# Altium project NixieProject.PrjPcb
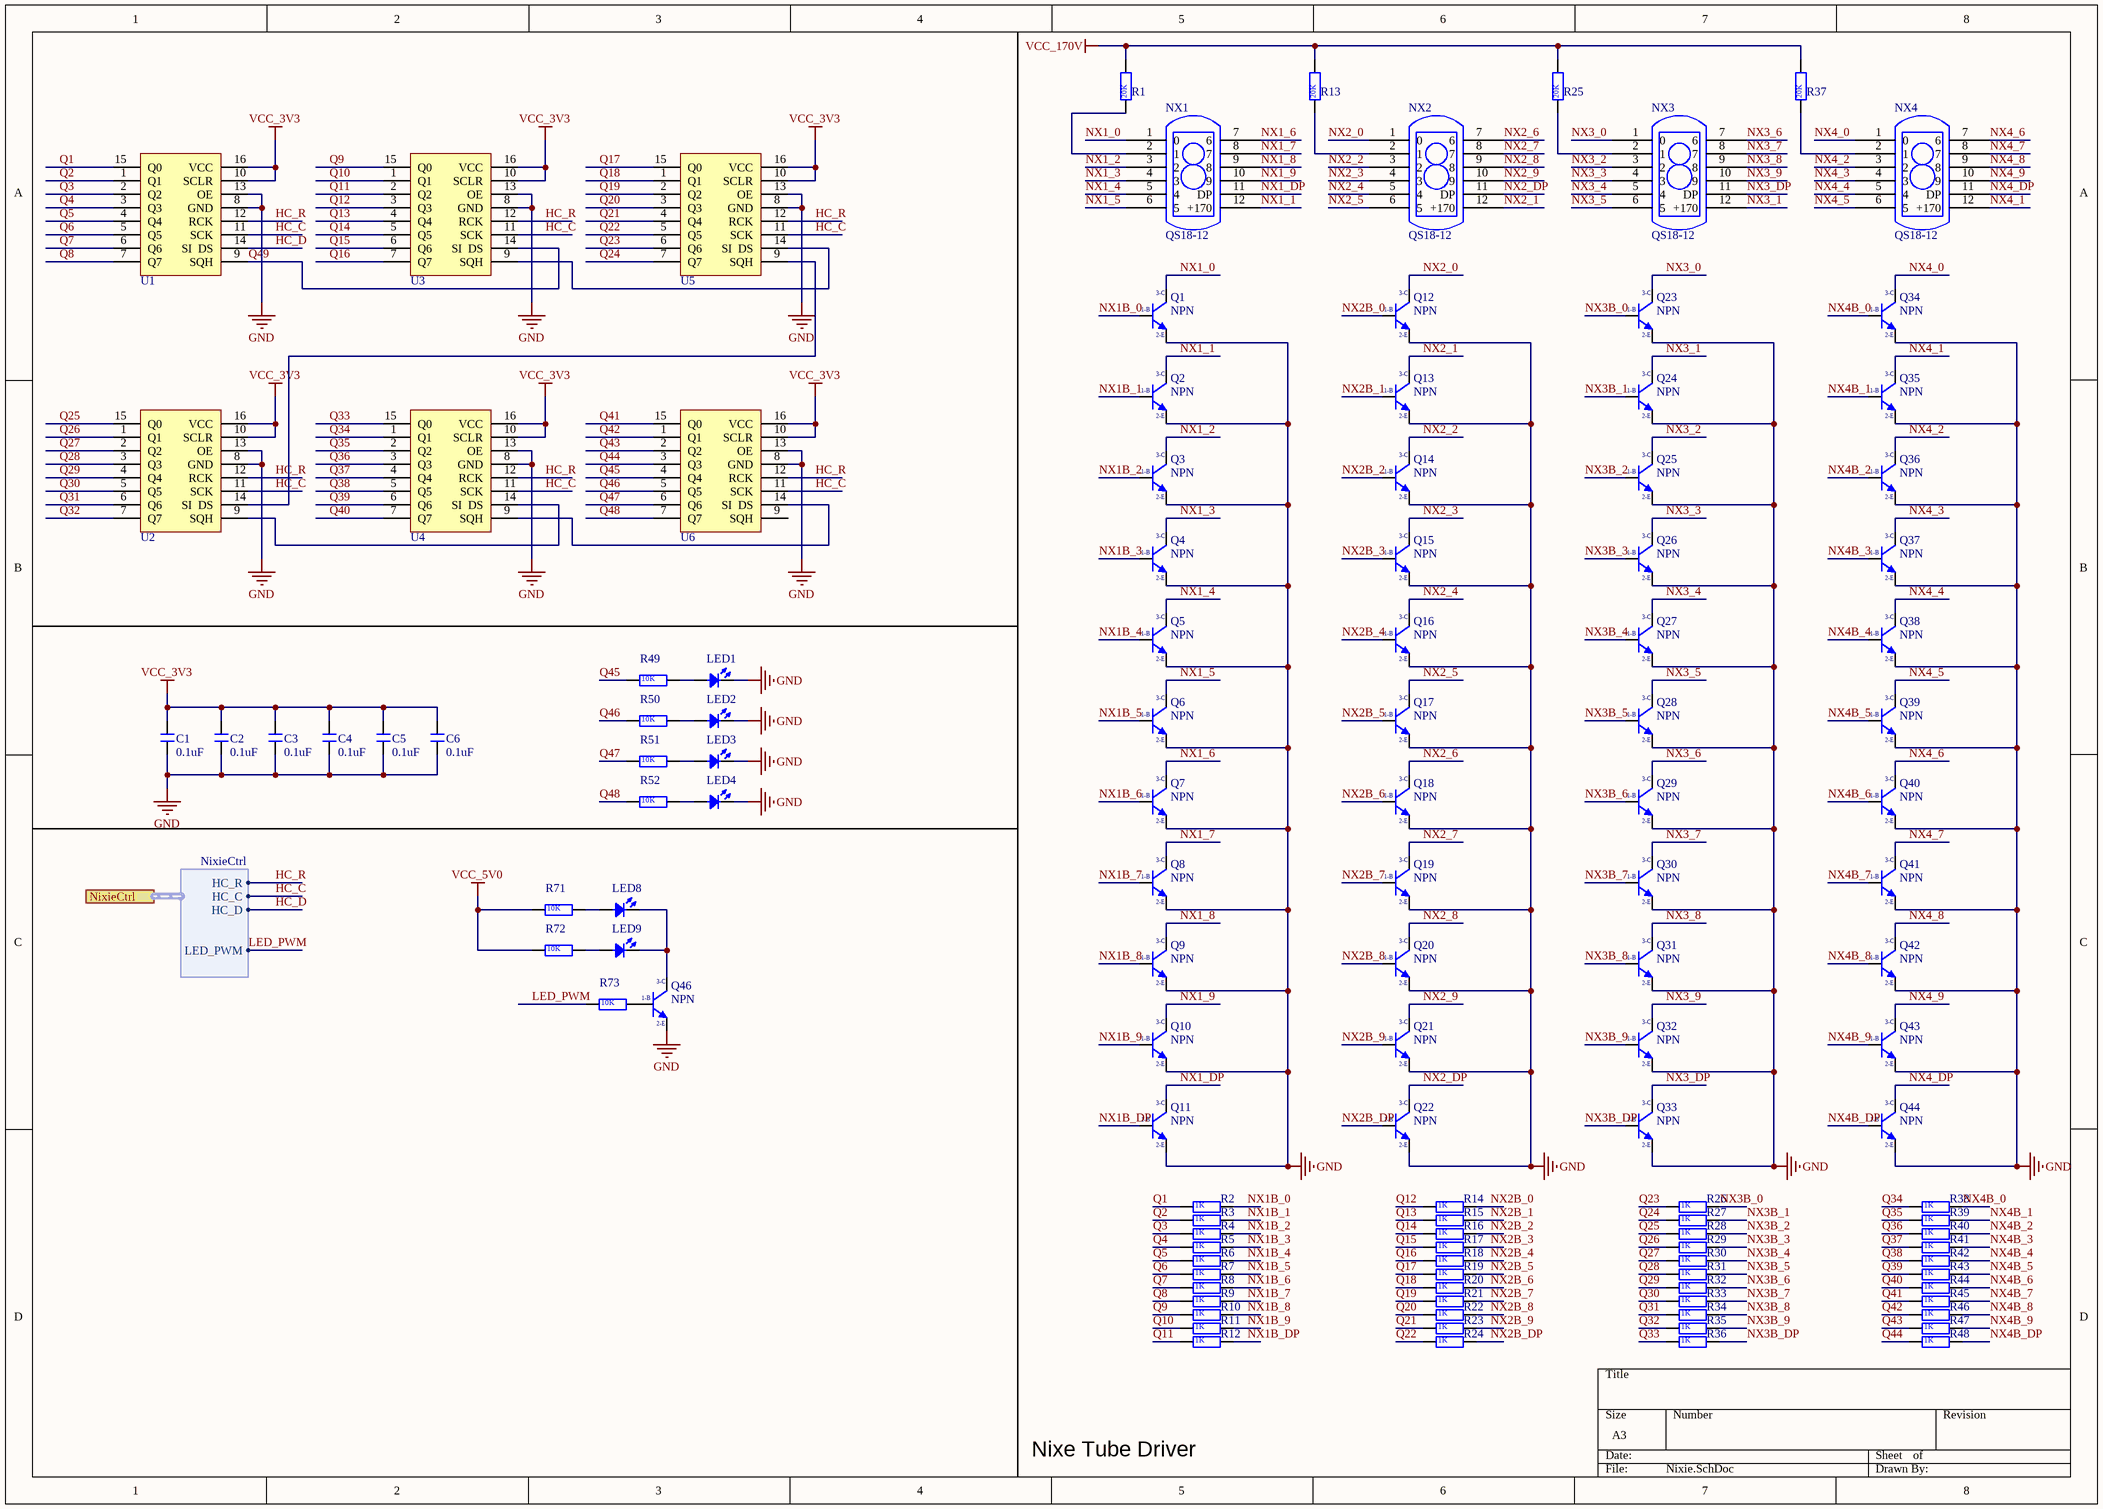
[diagram p0: Nixie.SchDoc]
3 sheets, 184 parts. Net scope: flat (ports and power ports of the same name join across sheets).
Board file: NixiePCB_V1.00.PcbDoc
Sheets:
  Nixie.SchDoc
  Controller.SchDoc
  PowerTree.SchDoc

## Sheet Nixie.SchDoc
size A3

### Parts
C1  0.1uF  [C 0805]
C2  0.1uF  [C 0805]
C3  0.1uF  [C 0805]
C4  0.1uF  [C 0805]
C5  0.1uF  [C 0805]
C6  0.1uF  [C 0805]
LED1  LED  [0805D]  (value not drawn)
LED2  LED  [0805D]  (value not drawn)
LED3  LED  [0805D]  (value not drawn)
LED4  LED  [0805D]  (value not drawn)
LED8  LED  [LED 5MM-B]  (value not drawn)
LED9  LED  [LED 5MM-B]  (value not drawn)
NX1  QS18-12  [PCBComponent_1]
NX2  QS18-12  [PCBComponent_1]
NX3  QS18-12  [PCBComponent_1]
NX4  QS18-12  [PCBComponent_1]
Q1  NPN  [SOT-23]
Q2  NPN  [SOT-23]
Q3  NPN  [SOT-23]
Q4  NPN  [SOT-23]
Q5  NPN  [SOT-23]
Q6  NPN  [SOT-23]
Q7  NPN  [SOT-23]
Q8  NPN  [SOT-23]
Q9  NPN  [SOT-23]
Q10  NPN  [SOT-23]
Q11  NPN  [SOT-23]
Q12  NPN  [SOT-23]
Q13  NPN  [SOT-23]
Q14  NPN  [SOT-23]
Q15  NPN  [SOT-23]
Q16  NPN  [SOT-23]
Q17  NPN  [SOT-23]
Q18  NPN  [SOT-23]
Q19  NPN  [SOT-23]
Q20  NPN  [SOT-23]
Q21  NPN  [SOT-23]
Q22  NPN  [SOT-23]
Q23  NPN  [SOT-23]
Q24  NPN  [SOT-23]
Q25  NPN  [SOT-23]
Q26  NPN  [SOT-23]
Q27  NPN  [SOT-23]
Q28  NPN  [SOT-23]
Q29  NPN  [SOT-23]
Q30  NPN  [SOT-23]
Q31  NPN  [SOT-23]
Q32  NPN  [SOT-23]
Q33  NPN  [SOT-23]
Q34  NPN  [SOT-23]
Q35  NPN  [SOT-23]
Q36  NPN  [SOT-23]
Q37  NPN  [SOT-23]
Q38  NPN  [SOT-23]
Q39  NPN  [SOT-23]
Q40  NPN  [SOT-23]
Q41  NPN  [SOT-23]
Q42  NPN  [SOT-23]
Q43  NPN  [SOT-23]
Q44  NPN  [SOT-23]
Q46  NPN  [SOT-23]
R1  value 20K  [R 0603]  (hidden comment: R)
R2  value 1K  [R 0603]  (hidden comment: R)
R3  value 1K  [R 0603]  (hidden comment: R)
R4  value 1K  [R 0603]  (hidden comment: R)
R5  value 1K  [R 0603]  (hidden comment: R)
R6  value 1K  [R 0603]  (hidden comment: R)
R7  value 1K  [R 0603]  (hidden comment: R)
R8  value 1K  [R 0603]  (hidden comment: R)
R9  value 1K  [R 0603]  (hidden comment: R)
R10  value 1K  [R 0603]  (hidden comment: R)
R11  value 1K  [R 0603]  (hidden comment: R)
R12  value 1K  [R 0603]  (hidden comment: R)
R13  value 20K  [R 0603]  (hidden comment: R)
R14  value 1K  [R 0603]  (hidden comment: R)
R15  value 1K  [R 0603]  (hidden comment: R)
R16  value 1K  [R 0603]  (hidden comment: R)
R17  value 1K  [R 0603]  (hidden comment: R)
R18  value 1K  [R 0603]  (hidden comment: R)
R19  value 1K  [R 0603]  (hidden comment: R)
R20  value 1K  [R 0603]  (hidden comment: R)
R21  value 1K  [R 0603]  (hidden comment: R)
R22  value 1K  [R 0603]  (hidden comment: R)
R23  value 1K  [R 0603]  (hidden comment: R)
R24  value 1K  [R 0603]  (hidden comment: R)
R25  value 20K  [R 0603]  (hidden comment: R)
R26  value 1K  [R 0603]  (hidden comment: R)
R27  value 1K  [R 0603]  (hidden comment: R)
R28  value 1K  [R 0603]  (hidden comment: R)
R29  value 1K  [R 0603]  (hidden comment: R)
R30  value 1K  [R 0603]  (hidden comment: R)
R31  value 1K  [R 0603]  (hidden comment: R)
R32  value 1K  [R 0603]  (hidden comment: R)
R33  value 1K  [R 0603]  (hidden comment: R)
R34  value 1K  [R 0603]  (hidden comment: R)
R35  value 1K  [R 0603]  (hidden comment: R)
R36  value 1K  [R 0603]  (hidden comment: R)
R37  value 20K  [R 0603]  (hidden comment: R)
R38  value 1K  [R 0603]  (hidden comment: R)
R39  value 1K  [R 0603]  (hidden comment: R)
R40  value 1K  [R 0603]  (hidden comment: R)
R41  value 1K  [R 0603]  (hidden comment: R)
R42  value 1K  [R 0603]  (hidden comment: R)
R43  value 1K  [R 0603]  (hidden comment: R)
R44  value 1K  [R 0603]  (hidden comment: R)
R45  value 1K  [R 0603]  (hidden comment: R)
R46  value 1K  [R 0603]  (hidden comment: R)
R47  value 1K  [R 0603]  (hidden comment: R)
R48  value 1K  [R 0603]  (hidden comment: R)
R49  value 10K  [R 0603]  (hidden comment: R)
R50  value 10K  [R 0603]  (hidden comment: R)
R51  value 10K  [R 0603]  (hidden comment: R)
R52  value 10K  [R 0603]  (hidden comment: R)
R71  value 10K  [R 0603]  (hidden comment: R)
R72  value 10K  [R 0603]  (hidden comment: R)
R73  value 10K  [R 0603]  (hidden comment: R)
U1  74HC595  [SOP16_M]  (value not drawn)
U2  74HC595  [SOP16_M]  (value not drawn)
U3  74HC595  [SOP16_M]  (value not drawn)
U4  74HC595  [SOP16_M]  (value not drawn)
U5  74HC595  [SOP16_M]  (value not drawn)
U6  74HC595  [SOP16_M]  (value not drawn)

### Ports
NixieCtrl (harness NixieCtrl)

### Harnesses
NixieCtrl: HC_R, HC_C, HC_D, LED_PWM

### Nets
GND: C1.2 C2.2 C3.2 C4.2 C5.2 C6.2 LED1.2(K) LED2.2(K) LED3.2(K) LED4.2(K) Q1.2(E) Q2.2(E) Q3.2(E) Q4.2(E) Q5.2(E) Q6.2(E) Q7.2(E) Q8.2(E) Q9.2(E) Q10.2(E) Q11.2(E) Q12.2(E) Q13.2(E) Q14.2(E) Q15.2(E) Q16.2(E) Q17.2(E) Q18.2(E) Q19.2(E) Q20.2(E) Q21.2(E) Q22.2(E) Q23.2(E) Q24.2(E) Q25.2(E) Q26.2(E) Q27.2(E) Q28.2(E) Q29.2(E) Q30.2(E) Q31.2(E) Q32.2(E) Q33.2(E) Q34.2(E) Q35.2(E) Q36.2(E) Q37.2(E) Q38.2(E) Q39.2(E) Q40.2(E) Q41.2(E) Q42.2(E) Q43.2(E) Q44.2(E) Q46.2(E) U1.8(GND) U1.13(OE) U2.8(GND) U2.13(OE) U3.8(GND) U3.13(OE) U4.8(GND) U4.13(OE) U5.8(GND) U5.13(OE) U6.8(GND) U6.13(OE)
VCC_3V3: C1.1 C2.1 C3.1 C4.1 C5.1 C6.1 U1.10(SCLR) U1.16(VCC) U2.10(SCLR) U2.16(VCC) U3.10(SCLR) U3.16(VCC) U4.10(SCLR) U4.16(VCC) U5.10(SCLR) U5.16(VCC) U6.10(SCLR) U6.16(VCC)  [project net +3.3V]
VCC_5V0: R71.1 R72.1
VCC_170V: R1.2 R13.2 R25.2 R37.2
HC_C: U1.11(SCK) U2.11(SCK) U3.11(SCK) U4.11(SCK) U5.11(SCK) U6.11(SCK) ; port NixieCtrl.HC_C
HC_D: U1.14(SI__DS) ; port NixieCtrl.HC_D
HC_R: U1.12(RCK) U2.12(RCK) U3.12(RCK) U4.12(RCK) U5.12(RCK) U6.12(RCK) ; port NixieCtrl.HC_R
LED_PWM: R73.1 ; port NixieCtrl.LED_PWM
NX1_0: NX1.1(0) Q1.3(C)
NX1_1: NX1.12(+170) Q2.3(C)
NX1_2: NX1.3(2) Q3.3(C)
NX1_3: NX1.4(3) Q4.3(C)
NX1_4: NX1.5(4) Q5.3(C)
NX1_5: NX1.6(5) Q6.3(C)
NX1_6: NX1.7(6) Q7.3(C)
NX1_7: NX1.8(7) Q8.3(C)
NX1_8: NX1.9(8) Q9.3(C)
NX1_9: NX1.10(9) Q10.3(C)
NX1_DP: NX1.11(DP) Q11.3(C)
NX1B_0: Q1.1(B) R2.2
NX1B_1: Q2.1(B) R3.2
NX1B_2: Q3.1(B) R4.2
NX1B_3: Q4.1(B) R5.2
NX1B_4: Q5.1(B) R6.2
NX1B_5: Q6.1(B) R7.2
NX1B_6: Q7.1(B) R8.2
NX1B_7: Q8.1(B) R9.2
NX1B_8: Q9.1(B) R10.2
NX1B_9: Q10.1(B) R11.2
NX1B_DP: Q11.1(B) R12.2
NX2_0: NX2.1(0) Q12.3(C)
NX2_1: NX2.12(+170) Q13.3(C)
NX2_2: NX2.3(2) Q14.3(C)
NX2_3: NX2.4(3) Q15.3(C)
NX2_4: NX2.5(4) Q16.3(C)
NX2_5: NX2.6(5) Q17.3(C)
NX2_6: NX2.7(6) Q18.3(C)
NX2_7: NX2.8(7) Q19.3(C)
NX2_8: NX2.9(8) Q20.3(C)
NX2_9: NX2.10(9) Q21.3(C)
NX2_DP: NX2.11(DP) Q22.3(C)
NX2B_0: Q12.1(B) R14.2
NX2B_1: Q13.1(B) R15.2
NX2B_2: Q14.1(B) R16.2
NX2B_3: Q15.1(B) R17.2
NX2B_4: Q16.1(B) R18.2
NX2B_5: Q17.1(B) R19.2
NX2B_6: Q18.1(B) R20.2
NX2B_7: Q19.1(B) R21.2
NX2B_8: Q20.1(B) R22.2
NX2B_9: Q21.1(B) R23.2
NX2B_DP: Q22.1(B) R24.2
NX3_0: NX3.1(0) Q23.3(C)
NX3_1: NX3.12(+170) Q24.3(C)
NX3_2: NX3.3(2) Q25.3(C)
NX3_3: NX3.4(3) Q26.3(C)
NX3_4: NX3.5(4) Q27.3(C)
NX3_5: NX3.6(5) Q28.3(C)
NX3_6: NX3.7(6) Q29.3(C)
NX3_7: NX3.8(7) Q30.3(C)
NX3_8: NX3.9(8) Q31.3(C)
NX3_9: NX3.10(9) Q32.3(C)
NX3_DP: NX3.11(DP) Q33.3(C)
NX3B_0: Q23.1(B) R26.2
NX3B_1: Q24.1(B) R27.2
NX3B_2: Q25.1(B) R28.2
NX3B_3: Q26.1(B) R29.2
NX3B_4: Q27.1(B) R30.2
NX3B_5: Q28.1(B) R31.2
NX3B_6: Q29.1(B) R32.2
NX3B_7: Q30.1(B) R33.2
NX3B_8: Q31.1(B) R34.2
NX3B_9: Q32.1(B) R35.2
NX3B_DP: Q33.1(B) R36.2
NX4_0: NX4.1(0) Q34.3(C)
NX4_1: NX4.12(+170) Q35.3(C)
NX4_2: NX4.3(2) Q36.3(C)
NX4_3: NX4.4(3) Q37.3(C)
NX4_4: NX4.5(4) Q38.3(C)
NX4_5: NX4.6(5) Q39.3(C)
NX4_6: NX4.7(6) Q40.3(C)
NX4_7: NX4.8(7) Q41.3(C)
NX4_8: NX4.9(8) Q42.3(C)
NX4_9: NX4.10(9) Q43.3(C)
NX4_DP: NX4.11(DP) Q44.3(C)
NX4B_0: Q34.1(B) R38.2
NX4B_1: Q35.1(B) R39.2
NX4B_2: Q36.1(B) R40.2
NX4B_3: Q37.1(B) R41.2
NX4B_4: Q38.1(B) R42.2
NX4B_5: Q39.1(B) R43.2
NX4B_6: Q40.1(B) R44.2
NX4B_7: Q41.1(B) R45.2
NX4B_8: Q42.1(B) R46.2
NX4B_9: Q43.1(B) R47.2
NX4B_DP: Q44.1(B) R48.2
Q1: R2.1 U1.15(Q0)
Q2: R3.1 U1.1(Q1)
Q3: R4.1 U1.2(Q2)
Q4: R5.1 U1.3(Q3)
Q5: R6.1 U1.4(Q4)
Q6: R7.1 U1.5(Q5)
Q7: R8.1 U1.6(Q6)
Q8: R9.1 U1.7(Q7)
Q9: R10.1 U3.15(Q0)
Q10: R11.1 U3.1(Q1)
Q11: R12.1 U3.2(Q2)
Q12: R14.1 U3.3(Q3)
Q13: R15.1 U3.4(Q4)
Q14: R16.1 U3.5(Q5)
Q15: R17.1 U3.6(Q6)
Q16: R18.1 U3.7(Q7)
Q17: R19.1 U5.15(Q0)
Q18: R20.1 U5.1(Q1)
Q19: R21.1 U5.2(Q2)
Q20: R22.1 U5.3(Q3)
Q21: R23.1 U5.4(Q4)
Q22: R24.1 U5.5(Q5)
Q23: R26.1 U5.6(Q6)
Q24: R27.1 U5.7(Q7)
Q25: R28.1 U2.15(Q0)
Q26: R29.1 U2.1(Q1)
Q27: R30.1 U2.2(Q2)
Q28: R31.1 U2.3(Q3)
Q29: R32.1 U2.4(Q4)
Q30: R33.1 U2.5(Q5)
Q31: R34.1 U2.6(Q6)
Q32: R35.1 U2.7(Q7)
Q33: R36.1 U4.15(Q0)
Q34: R38.1 U4.1(Q1)
Q35: R39.1 U4.2(Q2)
Q36: R40.1 U4.3(Q3)
Q37: R41.1 U4.4(Q4)
Q38: R42.1 U4.5(Q5)
Q39: R43.1 U4.6(Q6)
Q40: R44.1 U4.7(Q7)
Q41: R45.1 U6.15(Q0)
Q42: R46.1 U6.1(Q1)
Q43: R47.1 U6.2(Q2)
Q44: R48.1 U6.3(Q3)
Q45: R49.1 U6.4(Q4)
Q46: R50.1 U6.5(Q5)
Q47: R51.1 U6.6(Q6)
Q48: R52.1 U6.7(Q7)
Q49: U1.9(SQH) U3.14(SI__DS)
NetLED1_1: LED1.1(A) R49.2
NetLED2_1: LED2.1(A) R50.2
NetLED3_1: LED3.1(A) R51.2
NetLED4_1: LED4.1(A) R52.2
NetLED8_1: LED8.1(A) R71.2
NetLED8_2: LED8.2(K) LED9.2(K) Q46.3(C)
NetLED9_1: LED9.1(A) R72.2
NetNX1_2: NX1.2(1) R1.1
NetNX2_2: NX2.2(1) R13.1
NetNX3_2: NX3.2(1) R25.1
NetNX4_2: NX4.2(1) R37.1
NetQ46_1: Q46.1(B) R73.2
NetU2_9: U2.9(SQH) U4.14(SI__DS)
NetU2_14: U2.14(SI__DS) U5.9(SQH)
NetU3_9: U3.9(SQH) U5.14(SI__DS)
NetU4_9: U4.9(SQH) U6.14(SI__DS)

Not connected (* = marked no-connect by the designer): U6 9(SQH)

### Notes on the sheet
- Nixe Tube Driver
- (in symbol NPN-S8050-SOT-23) 3-C; 1-B; 2-E

### Library data of the parts
C1-C6 = C: 无极性贴片电容; 版权归属: 源创客; BOM名称: 无极性贴片电容; 学习资源: www.ooocke.com
Q1-Q44 Q46 = NPN-S8050-SOT-23
U1-U6 = 74HC595_1
LED1-LED4 LED8 LED9 = LED: Published: 8-Jun-2000; LatestRevisionDate: 08-Jul-2005; LatestRevisionNote: Mech Layer 1 removed.; PackageReference: LED-0; Publisher: Altium Limited; PackageDescription: LED; 2 Leads

## Sheet Controller.SchDoc
size A4
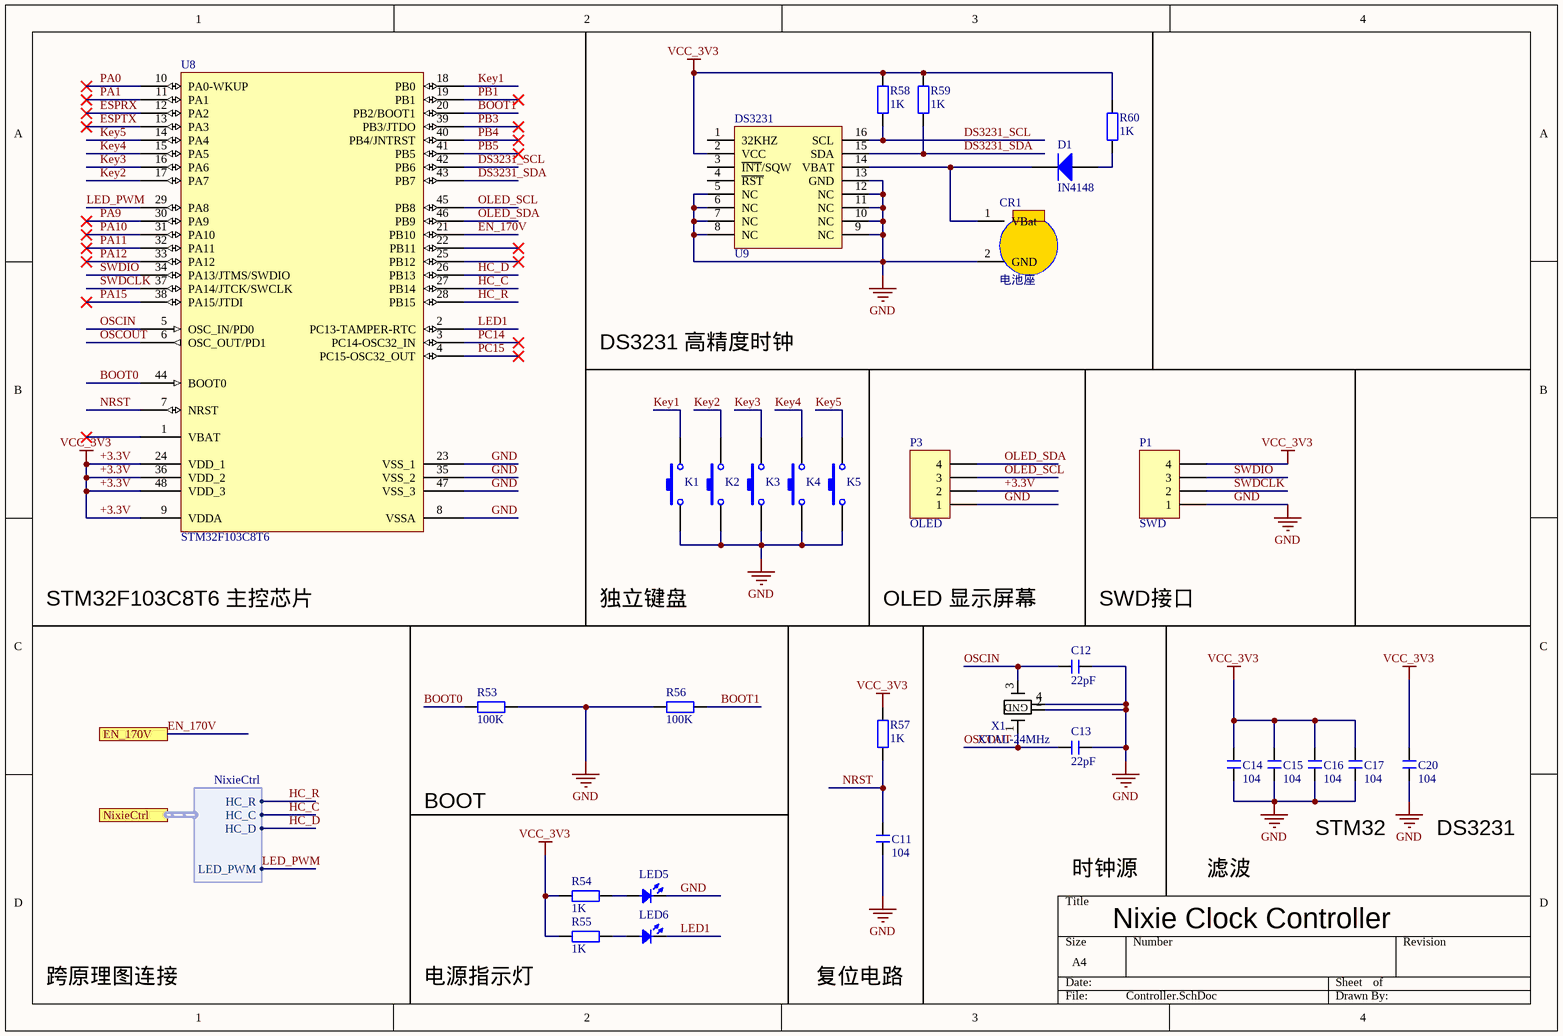
[diagram p1: Controller.SchDoc]

### Parts
C11  104  [C 0603]
C12  22pF  [C 0603]
C13  22pF  [C 0603]
C14  104  [C 0603]
C15  104  [C 0603]
C16  104  [C 0603]
C17  104  [C 0603]
C20  104  [C 0603]
CR1  电池座  [BAT-2P]
D1  IN4148  [0805D]
K1  按键  [TSW 3*6*4.3-S-W]  (value not drawn)
K2  按键  [TSW 3*6*4.3-S-W]  (value not drawn)
K3  按键  [TSW 3*6*4.3-S-W]  (value not drawn)
K4  按键  [TSW 3*6*4.3-S-W]  (value not drawn)
K5  按键  [TSW 3*6*4.3-S-W]  (value not drawn)
LED5  LED  [0805D]  (value not drawn)
LED6  LED  [0805D]  (value not drawn)
P1  SWD  [HDR1X4]
P3  OLED  [HDR1X4]
R53  100K  [R 0603]
R54  1K  [R 0603]
R55  1K  [R 0603]
R56  100K  [R 0603]
R57  1K  [R 0603]
R58  1K  [R 0603]
R59  1K  [R 0603]
R60  1K  [R 0603]
U8  STM32F103C8T6  [LQFP48 7X7_M]
U9  DS3231  [SOL-16]
X1  XTAL-24MHz  [XTAL-3225]

### Ports
EN_170V, NixieCtrl (harness NixieCtrl)

### Harnesses
NixieCtrl: HC_R, HC_C, HC_D, LED_PWM

### Nets
+3.3V: C14.1 C15.1 C16.1 C17.1 C20.2 P1.4 P3.2 R54.1 R55.1 R57.2 R58.2 R59.2 R60.1 U8.9(VDDA) U8.24(VDD_1) U8.36(VDD_2) U8.48(VDD_3) U9.2(VCC)  [also labelled VCC_3V3]
GND: C11.1 C12.2 C13.2 C14.2 C15.2 C16.2 C17.2 C20.1 CR1.2(GND) K1.1 K2.1 K3.1 K4.1 K5.1 LED5.2(K) P1.1 P3.1 R53.2 R56.1 U8.8(VSSA) U8.23(VSS_1) U8.35(VSS_2) U8.47(VSS_3) U9.5(NC) U9.6(NC) U9.7(NC) U9.8(NC) U9.9(NC) U9.10(NC) U9.11(NC) U9.12(NC) U9.13(GND) X1.2 X1.4
BOOT0: R53.1 U8.44(BOOT0)
BOOT1: R56.2 U8.20(PB2/BOOT1)
DS3231_SCL: R58.1 U8.42(PB6) U9.16(SCL)
DS3231_SDA: R59.1 U8.43(PB7) U9.15(SDA)
EN_170V: U8.21(PB10) ; port EN_170V
ESPRX: U8.12(PA2)
ESPTX: U8.13(PA3)
HC_C: U8.27(PB14) ; port NixieCtrl.HC_C
HC_D: U8.26(PB13) ; port NixieCtrl.HC_D
HC_R: U8.28(PB15) ; port NixieCtrl.HC_R
Key1: K1.2 U8.18(PB0)
Key2: K2.2 U8.17(PA7)
Key3: K3.2 U8.16(PA6)
Key4: K4.2 U8.15(PA5)
Key5: K5.2 U8.14(PA4)
LED1: LED6.2(K) U8.2(PC13-TAMPER-RTC)
LED_PWM: U8.29(PA8) ; port NixieCtrl.LED_PWM
NRST: C11.2 R57.1 U8.7(NRST)
OLED_SCL: P3.3 U8.45(PB8)
OLED_SDA: P3.4 U8.46(PB9)
OSCIN: C12.1 U8.5(OSC_IN/PD0) X1.3(GND)
OSCOUT: C13.1 U8.6(OSC_OUT/PD1) X1.1
PA0: U8.10(PA0-WKUP)
PA1: U8.11(PA1)
PA9: U8.30(PA9)
PA10: U8.31(PA10)
PA11: U8.32(PA11)
PA12: U8.33(PA12)
PA15: U8.38(PA15/JTDI)
PB1: U8.19(PB1)
PB3: U8.39(PB3/JTDO)
PB4: U8.40(PB4/JNTRST)
PB5: U8.41(PB5)
PC14: U8.3(PC14-OSC32_IN)
PC15: U8.4(PC15-OSC32_OUT)
SWDCLK: P1.2 U8.37(PA14/JTCK/SWCLK)
SWDIO: P1.3 U8.34(PA13/JTMS/SWDIO)
NetCR1_1: CR1.1(VBat) D1.2(K) U9.14(VBAT)
NetD1_1: D1.1(A) R60.2
NetLED5_1: LED5.1(A) R54.2
NetLED6_1: LED6.1(A) R55.2

Not connected (* = marked no-connect by the designer): U8 1(VBAT)* 22(PB11)* 25(PB12)*; U9 1(32KHZ) 3(~{INT}/SQW) 4(~{RST})

### Notes on the sheet
- DS3231 高精度时钟
- STM32F103C8T6 主控芯片
- 独立键盘
- OLED 显示屏幕
- SWD接口
- BOOT
- STM32
- DS3231
- 时钟源
- 滤波
- 跨原理图连接
- 电源指示灯
- 复位电路
- Nixie Clock Controller

### Library data of the parts
C11-C17 C20 = C: 无极性贴片电容; 版权归属: 源创客; BOM名称: 无极性贴片电容; 学习资源: www.ooocke.com
CR1 = CR2032 电池座
D1 = 二级管
P1 P3 = Header 4: Header, 4-Pin; LatestRevisionDate: 17-Jul-2002; LatestRevisionNote: Re-released for DXP Platform.; Publisher: Altium Limited
R53-R60 = R: 贴片电阻; 版权归属: 源创客; BOM名称: 贴片电阻; 学习资源: www.ooocke.com
U8 = STM32F103C8T6: Flaah:64/RAM:20/IO:36; BOM名称: 32位STM单片机; 版权归属: 源创客; 学习资源: www.ooocke.com
X1 = XTAL-SMD
LED5 LED6 = LED: Published: 8-Jun-2000; LatestRevisionDate: 08-Jul-2005; LatestRevisionNote: Mech Layer 1 removed.; PackageReference: LED-0; Publisher: Altium Limited; PackageDescription: LED; 2 Leads

## Sheet PowerTree.SchDoc
size A4
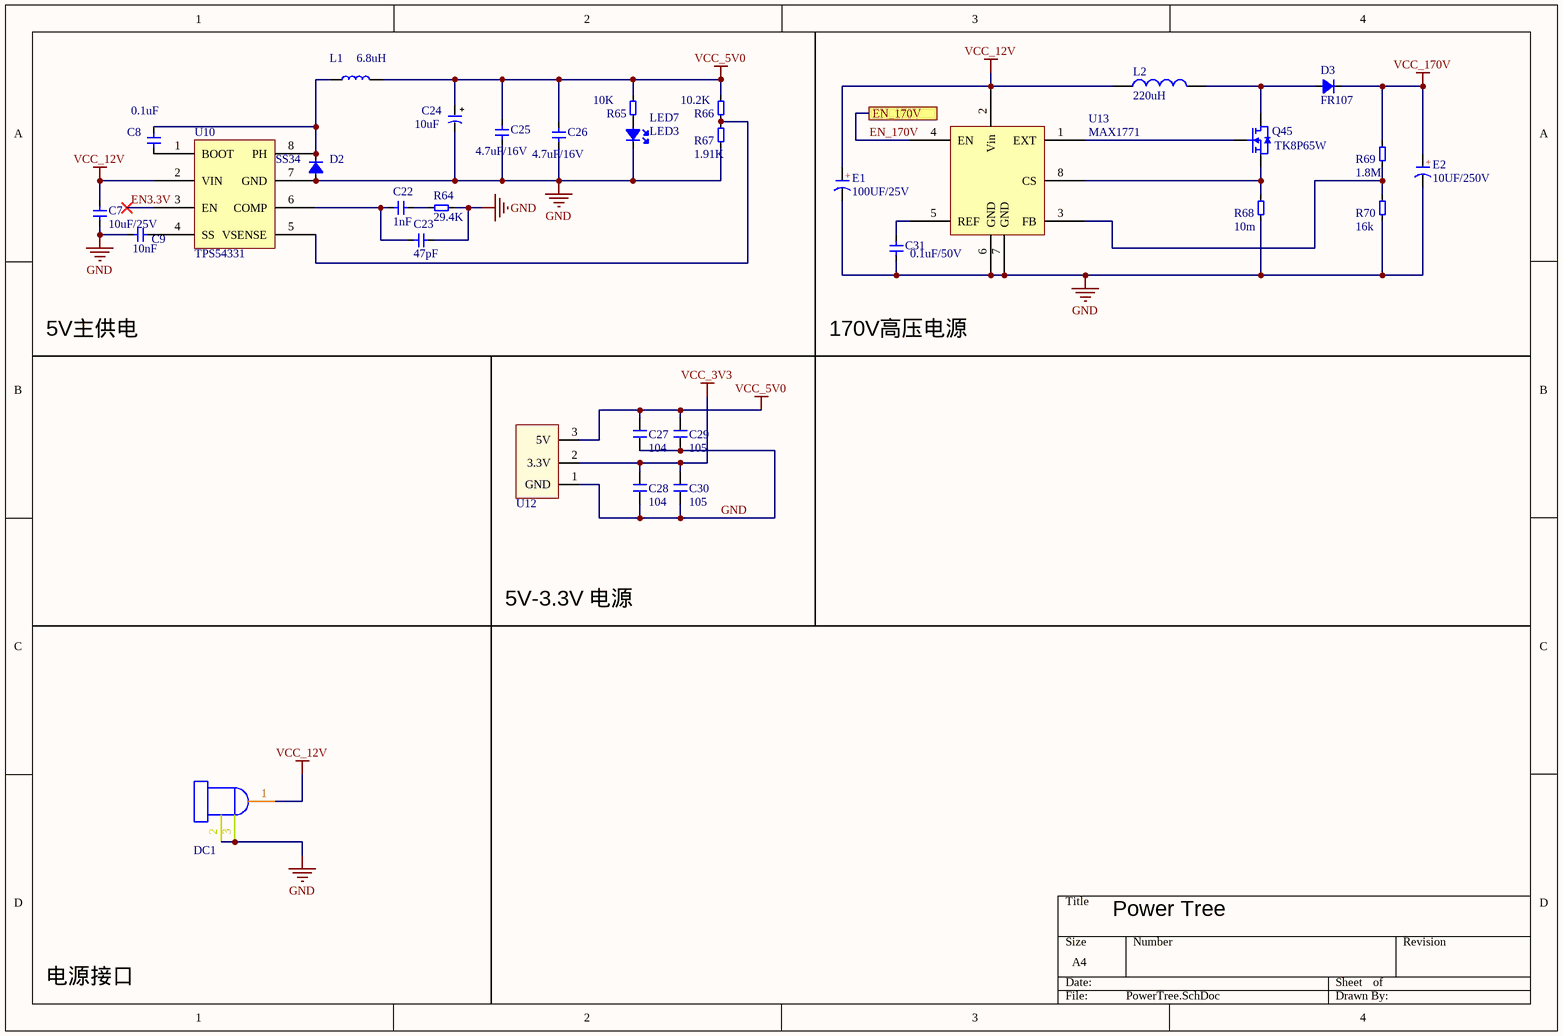
[diagram p2: PowerTree.SchDoc]

### Parts
C7  10uF/25V  [1206]
C8  0.1uF  [0603C]
C9  10nF  [0603C]
C22  1nF  [0603C]
C23  47pF  [0603C]
C24  10uF  [3528]
C25  4.7uF/16V  [0603C]
C26  4.7uF/16V  [0603C]
C27  104  [C 0805]
C28  104  [C 0805]
C29  105  [C 0805]
C30  105  [C 0805]
C31  0.1uF/50V  [0603C]
D2  SS34  [DO-214AC-SMA]
D3  FR107  [DO-214AC-SMA]
DC1  DC  [DC-005]  (value not drawn)
E1  100UF/25V  [CM D(6.3*7.7)]
E2  10UF/250V  [CM D(6.3*7.7)]
L1  6.8uH  [L100]
L2  220uH  [CDRH125]
LED7  LED3  [0603-led]
Q45  TK8P65W  [D-PAK]
R64  29.4K  [0603]
R65  10K  [0603]
R66  10.2K  [0603]
R67  1.91K  [0603]
R68  10m  [R 1206_L]
R69  1.8M  [0603]
R70  16k  [0603]
U10  TPS54331  [SO08]
U12  LM1117  [SOT223]  (value not drawn)
U13  MAX1771  [SOP8]

### Ports
EN_170V

### Nets
GND: C7.1 C9.2 C23.2 C24.2 C25.1 C26.1 C27.1 C28.1 C29.2 C30.2 C31.1 D2.1(A) DC1.2(-) DC1.3(-) E1.2(K) E2.2(K) LED7.2(K) R64.1 R67.1 R68.1 R70.1 U10.7(GND) U12.1(GND) U13.6(GND) U13.7(GND)
VCC_3V3: C28.2 C30.1 U12.2(3.3V)  [project net +3.3V]
VCC_5V0: C24.1 C25.2 C26.2 C27.2 C29.1 L1.1 R65.2 R66.2 U12.3(5V)
VCC_12V: C7.2 DC1.1(+) E1.1(A) L2.1 U10.2(VIN) U13.2(Vin)
VCC_170V: D3.2(K) E2.1(A) R69.2
EN3.3V: U10.3(EN)
EN_170V: U13.4(EN) ; port EN_170V
NetC8_1: C8.1 U10.1(BOOT)
NetC8_2: C8.2 D2.2(K) L1.2 U10.8(PH)
NetC9_1: C9.1 U10.4(SS)
NetC22_1: C22.1 R64.2
NetC22_2: C22.2 C23.1 U10.6(COMP)
NetC31_2: C31.2 U13.5(REF)
NetD3_1: D3.1(A) L2.2 Q45.3(D)
NetLED7_1: LED7.1(A) R65.1
NetQ45_1: Q45.1(G) U13.1(EXT)
NetQ45_2: Q45.2(S) R68.2 U13.8(CS)
NetR66_1: R66.1 R67.2 U10.5(VSENSE)
NetR69_1: R69.1 R70.2 U13.3(FB)

### Notes on the sheet
- 5V主供电
- 170V高压电源
- 5V-3.3V 电源
- Power Tree
- 电源接口
- (in symbol C-CS) +
- (in symbol CAP-+) +

### Library data of the parts
C7 C9 C23 C25 C26 C31 = CAP1: Capacitor
C8 C22 = CAP1: Capacitor; 类型: 电容
C24 = CAP-+: Capacitor
C27-C30 = C: 无极性贴片电容; 版权归属: 源创客; BOM名称: 无极性贴片电容; 学习资源: www.ooocke.com
D2 D3 = DIOLED_1: DIODE LED
E1 E2 = C-CS: 直插固态电容; 版权归属: 源创客; BOM名称: 直插固态电容; 学习资源: www.ooocke.com
L1 = INDUCTOR1_1
L2 = L: 小功率贴片电感; 版权归属: 源创客; BOM名称: 小功率贴片电感; 学习资源: www.ooocke.com
LED7 = CP_DIOLED: DIODE LED
Q45 = MOSFET-N: P-channel Enhancement Mode MOSFET; Published: 17-Sep-2003; LatestRevisionDate: 12-Dec-2006; LatestRevisionNote: IPC-7351 Footprint Added.; DatasheetVersion: Aug-1998; PackageVersion: May-1999; PackageReference: SOT23; Publisher: Altium Limited; PackageDescription: 3-Pin SOT-23 Package 0.95 mm Pitch, 2.3 mm Lead Span; ComponentLink1Description: Manufacturer Link; ComponentLink1URL: http://www.semiconductors.philips.com/; ComponentLink2Description: Datasheet; ComponentLink2URL: http://www.semiconductors.philips.com/acrobat/datasheets/BSH201_3.pdf
R64-R70 = RES2

## Nets that join several sheets
+3.3V: Nixie (18 pins), Controller (18 pins), PowerTree (C28.2 C30.1 U12.2)
GND: Nixie (67 pins), Controller (34 pins), PowerTree (25 pins)
VCC_5V0: Nixie (R71.1 R72.1), PowerTree (9 pins)
VCC_170V: Nixie (R1.2 R13.2 R25.2 R37.2), PowerTree (D3.2 E2.1 R69.2)
EN_170V: Controller (U8.21), PowerTree (U13.4)
HC_C: Nixie (6 pins), Controller (U8.27)
HC_D: Nixie (U1.14), Controller (U8.26)
HC_R: Nixie (6 pins), Controller (U8.28)
LED_PWM: Nixie (R73.1), Controller (U8.29)